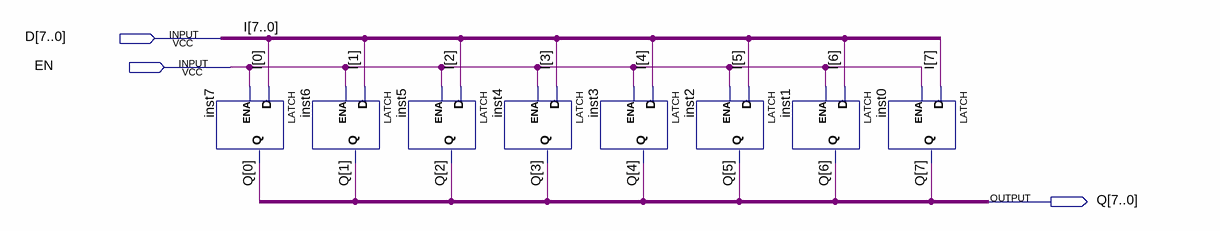
[diagram p0: schematic sheet]
// Quartus schematic Latch8bit.bdf as structural Verilog: 8 symbols, 3 pins
module Latch8bit (
  input  [7:0] D,
  input  EN,
  output [7:0] Q
);

  LATCH inst7 (.D(D[0]), .ENA(EN), .Q(Q[0]));
  LATCH inst6 (.D(D[1]), .ENA(EN), .Q(Q[1]));
  LATCH inst5 (.D(D[2]), .ENA(EN), .Q(Q[2]));
  LATCH inst4 (.D(D[3]), .ENA(EN), .Q(Q[3]));
  LATCH inst3 (.D(D[4]), .ENA(EN), .Q(Q[4]));
  LATCH inst2 (.D(D[5]), .ENA(EN), .Q(Q[5]));
  LATCH inst1 (.D(D[6]), .ENA(EN), .Q(Q[6]));
  LATCH inst0 (.D(D[7]), .ENA(EN), .Q(Q[7]));

  // Other names for the same wires on the sheet: I[7:0] = D
endmodule
